# Altium schematic sheet 02. Block diagram.SchDoc
size A3
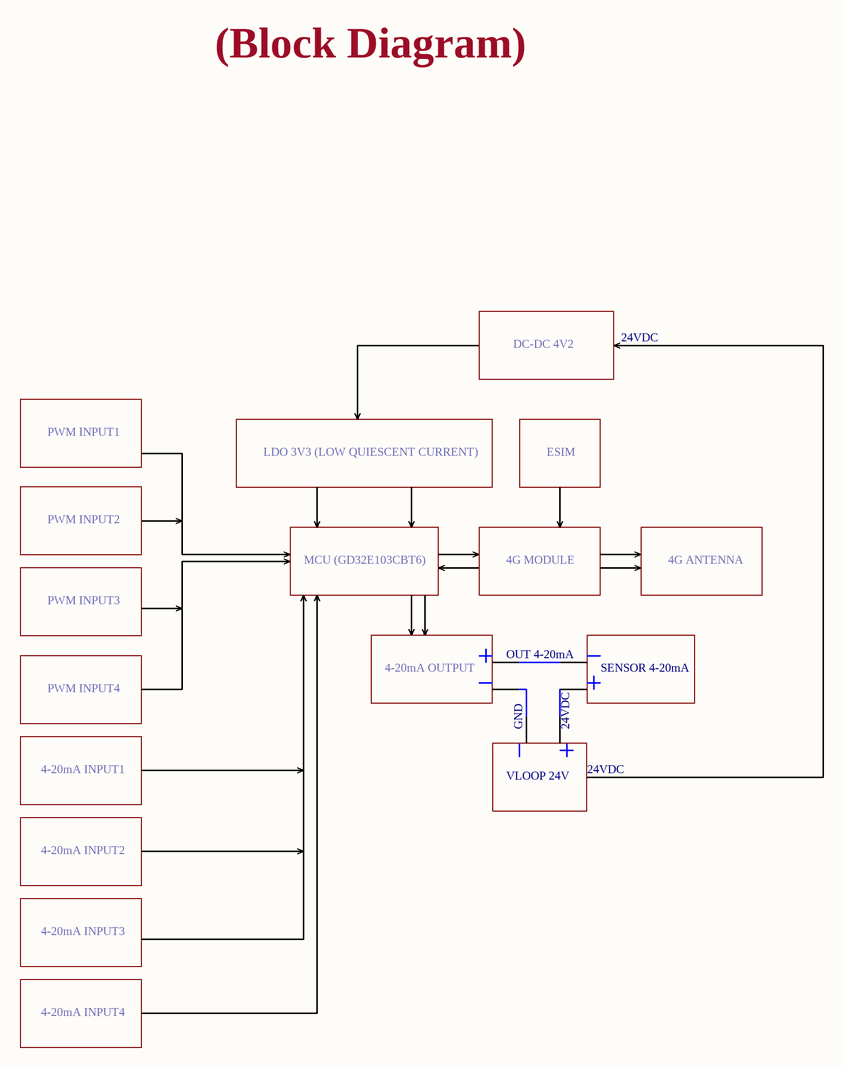
[diagram p0: 02. Block diagram.SchDoc]

## Notes on the sheet
- (Block Diagram)
- DC-DC 4V2
- 24VDC
- PWM INPUT1
- LDO 3V3 (LOW QUIESCENT CURRENT)
- ESIM
- PWM INPUT2
- PWM INPUT3
- MCU (GD32E103CBT6)
- 4G MODULE
- 4G ANTENNA
- 4-20mA OUTPUT
- OUT 4-20mA
- SENSOR 4-20mA
- PWM INPUT4
- GND
- 4-20mA INPUT1
- VLOOP 24V
- 4-20mA INPUT2
- 4-20mA INPUT3
- 4-20mA INPUT4
- File:
- Project:
- REV:
- Size:
- A2
- Sheet:
- Drawn By:
- Checked By:
- DRAFT
- Approved By: